# EAGLE design RPM EL311 (EAGLE 9.6.2)
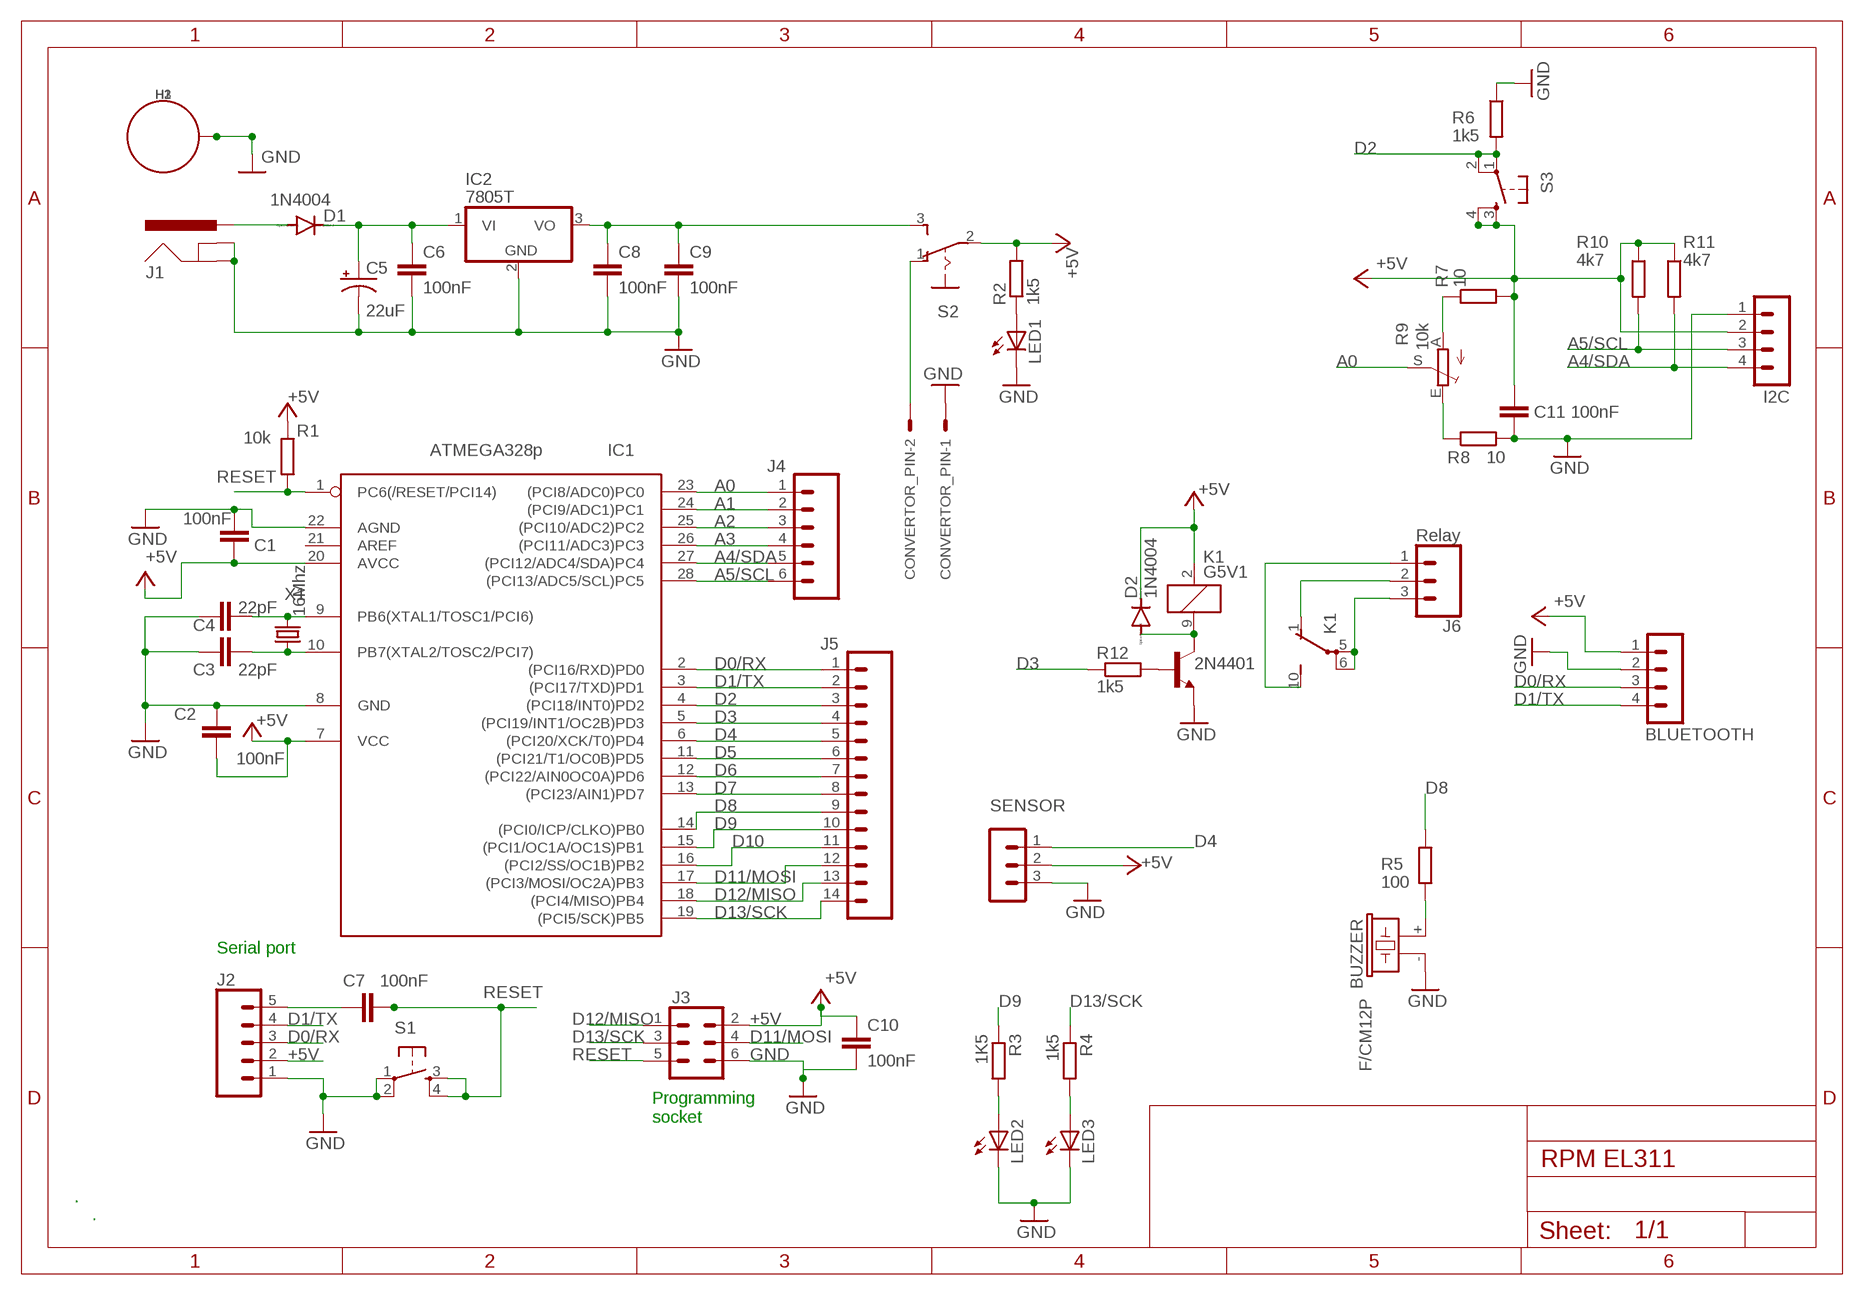
[diagram p0: schematic, sheet 1]

## Parts
2N4401  NPN_TRANSISTOR2N3904TO92-EBC  [TO92-EBC]
BLUETOOTH  MA04-1  [MA04-1]
BUZZER  F/CM12P  [F/CM12P]
C1  100nF  C2.5/2  [C2.5-2]
C2  100nF  C2.5/2  [C2.5-2]
C3  22pF  C2.5/2  [C2.5-2]
C4  22pF  C2.5/2  [C2.5-2]
C5  22uF  CPOL-USE2.5-7  [E2,5-7]
C6  100nF  C2.5/2  [C2.5-2]
C7  100nF  C2.5/2  [C2.5-2]
C8  100nF  C2.5/2  [C2.5-2]
C9  100nF  C2.5/2  [C2.5-2]
C10  100nF  C2.5/2  [C2.5-2]
C11  100nF  C2.5/2  [C2.5-2]
CONVERTOR_PIN  5V  CON-MOLEX_22-27-2021-02  [CON-MOLEX_6410-02]
D1  1N4004  [DO41-10]
D2  1N4004  [DO41-10]
H1  STANDOFF_ELECTRICAL  [STANDOFF-ELECTRICAL]
H2  STANDOFF_ELECTRICAL  [STANDOFF-ELECTRICAL]
H3  STANDOFF_ELECTRICAL  [STANDOFF-ELECTRICAL]
I2C  MA04-1  [MA04-1]
IC1  ATMEGA328p  ATMEGA168V-10P  [DIL28-3]
IC2  7805T  [TO220H]
J1  EL311-ROBOT_SPARKFUN-CONNECTORS_POWER_JACKPTH  [EL311-ROBOT_SPARKFUN-CONNECTORS_POWER_JACK_PTH]
J2  CONN_05  [1X05]
J3  FEMALE 2x3  CONN_03X2SHROUD  [2X3-SHROUDED]
J4  CONN_06SILK_FEMALE_PTH  [1X06]
J5  CONN_14  [1X14]
J6  Relay  CONN_03LONGPADS  [1X03_LONGPADS]
K1  G5V1  [G5V1]
LED1  LED3MM  [LED3MM]
LED2  LED3MM:1  [LED3MM]
LED3  LED3MM:1  [LED3MM]
R1  10k  R-EU_0207/10  [0207/10]
R2  1k5  R-EU_0207/10  [0207/10]
R3  1K5  R-EU_0207/10  [0207/10]
R4  1k5  R-EU_0207/10  [0207/10]
R5  100  R-EU_0207/10  [0207/10]
R6  1k5  R-EU_0207/10  [0207/10]
R7  10  R-EU_0207/10  [0207/10]
R8  10  R-EU_0207/10  [0207/10]
R9  10k  POT_TRIM_EU-RS3  [POT_RS3]
R10  4k7  R-EU_0207/10  [0207/10]
R11  4k7  R-EU_0207/10  [0207/10]
R12  1k5  R-EU_0207/10  [0207/10]
S1  EL311-ROBOT_SPARKFUN-ELECTROMECHANICAL_TAC_SWITCHPTH  [EL311-ROBOT_SPARKFUN-ELECTROMECHANICAL_TACTILE-PTH]
S2  SWITCH_M251  [SWITCH_M251]
S3  EL311-ROBOT_SPARKFUN-ELECTROMECHANICAL_TAC_SWITCHPTH  [EL311-ROBOT_SPARKFUN-ELECTROMECHANICAL_TACTILE-PTH]
SENSOR  MA03-1  [MA03-1]
X1  16Mhz  CRYSTALHC49U-V  [HC49U-V]

## Nets
0V: R8.1 R9.E
5V: R7.1 R9.A
+5V [power]: BLUETOOTH.1 C1.2 C2.2 C10.1 C11.1 D2.C I2C.2 IC1.7(VCC) IC1.20(AVCC) J2.2 J3.2 K1.2 R1.1 R2.2 R7.2 R10.1 R11.1 S2.2(P) S3.3 S3.4 SENSOR.2
A0: IC1.23((PCI8/ADC0)PC0) J4.1 R9.S
A1: IC1.24((PCI9/ADC1)PC1) J4.2
A2: IC1.25((PCI10/ADC2)PC2) J4.3
A3: IC1.26((PCI11/ADC3)PC3) J4.4
A4/SDA: I2C.4 IC1.27((PCI12/ADC4/SDA)PC4) J4.5 R11.2
A5/SCL: I2C.3 IC1.28((PCI13/ADC5/SCL)PC5) J4.6 R10.2
CONVERTOR: CONVERTOR_PIN.2 S2.1(O)
D0/RX: BLUETOOTH.3 IC1.2((PCI16/RXD)PD0) J2.3 J5.1
D1/TX: BLUETOOTH.4 IC1.3((PCI17/TXD)PD1) J2.4 J5.2
D2: IC1.4((PCI18/INT0)PD2) J5.3 R6.2 S3.1 S3.2
D3: IC1.5((PCI19/INT1/OC2B)PD3) J5.4 R12.1
D4: IC1.6((PCI20/XCK/T0)PD4) J5.5 SENSOR.1
D5: IC1.11((PCI21/T1/OC0B)PD5) J5.6
D6: IC1.12((PCI22/AIN0OC0A)PD6) J5.7
D7: IC1.13((PCI23/AIN1)PD7) J5.8
D8: IC1.14((PCI0/ICP/CLKO)PB0) J5.9 R5.1
D9: IC1.15((PCI1/OC1A/OC1S)PB1) J5.10 R3.1
D10: IC1.16((PCI2/SS/OC1B)PB2) J5.11
D11/MOSI: IC1.17((PCI3/MOSI/OC2A)PB3) J3.4 J5.12
D12/MISO: IC1.18((PCI4/MISO)PB4) J3.1 J5.13
D13/SCK: IC1.19((PCI5/SCK)PB5) J3.3 J5.14 R4.1
GND [power]: 2N4401.E BLUETOOTH.2 BUZZER.- C1.1 C2.1 C3.1 C4.1 C5.- C6.2 C8.2 C9.2 C10.2 C11.2 CONVERTOR_PIN.1 H1.P1 H2.P1 H3.P1 I2C.1 IC1.8(GND) IC1.22(AGND) IC2.2(GND) J1.GND J1.GNDBREAK J2.1 J3.6 LED1.K(C) LED2.K(C) LED3.K(C) R6.1 R8.2 S1.1 S1.2 SENSOR.3
LED2: LED2.A R3.2
LED3: LED3.A R4.2
N$9: J6.1 K1.10(2:S)
N$16: C3.2 IC1.10(PB7(XTAL2/TOSC2/PCI7)) X1.1
N$17: C4.2 IC1.9(PB6(XTAL1/TOSC1/PCI6)) X1.2
N$19: LED1.A R2.1
N$20: C7.1 J2.5
N$21: J6.2 K1.1(2:O)
N$22: J6.3 K1.5(2:P) K1.6(2:P)
N$23: 2N4401.C D2.A K1.9
N$24: 2N4401.B R12.2
PWR3 [power]: D1.A J1.PWR
PWR4 [power]: C5.+ C6.1 D1.C IC2.1(VI)
R5: BUZZER.+ R5.2
REGULATOR [power]: C8.1 C9.1 IC2.3(VO) S2.3(S)
RESET: C7.2 IC1.1(PC6(/RESET/PCI14)) J3.5 R1.2 S1.3 S1.4
Unconnected: IC1.21(AREF)

## Notes on the sheet
- Serial port
- Programming
  socket
- .
- .

## Library data of the parts
2N4401 = EL311_V1_2020:NPN_TRANSISTOR: NPN Transistor
BLUETOOTH I2C = con-lstb:MA04-1: PIN HEADER; OC_FARNELL: unknown; OC_NEWARK: unknown
BUZZER = buzzer:F/CM12P: BUZZER Source: Buerklin; OC_FARNELL: unknown; OC_NEWARK: unknown
C1-C4 C6-C11 = capacitor-wima:C: CAPACITOR naming: grid - package width
C5 = adafruit:CPOL-US: POLARIZED CAPACITOR, American symbol
CONVERTOR_PIN = EL311_V1_2020:CON-MOLEX_22-?-02: CONNECTOR wire to board 2.54 mm (.1 inch) pitch header; OC_FARNELL: unknown; OC_NEWARK: unknown
D1 = diode:1N4004: DIODE general purpose rectifier, 1 A
D2 = EL311_V1_2020:1N4004: DIODE general purpose rectifier, 1 A
H1-H3 = SparkFun-Hardware:STANDOFF_ELECTRICAL: Stand Off Drill holes with an electrical connection. For example, use these to ground your board to a chassis. Example SparkFun Products Screw - Phillips Head (1/4", 4-40, 10 pack) <https://www.sparkfun.com/products/10453> (PRT-10453) Screw - Phillips Head (1/2", 4-40, 10 pack) <https://www.sparkfun.com/products/10452> (PRT-10452) Screw - Phillips Head (3/4", 4-40, 10 pack) <https://www.sparkfun.com/products/10451> (PRT-10451) Screw - Phillips Head (1", 4-40, 10 pack) <https://www.sparkfun.com/products/10450> (PRT-10450)
IC1 = adafruit:ATMEGA168*P: MICROCONTROLLER 16 kBytes FLASH 1 kBytes SRAM 512 Bytes EEPROM USART 8-channel 10 bit ADC
IC2 = adafruit:78*: Positive VOLTAGE REGULATOR Added bigger pads to the TO-92 package
J1 = EL311_2017_18:EL311-ROBOT_SPARKFUN-CONNECTORS_POWER_JACK: Power Jack This is the standard 5.5mm barrel jack for power. The PTH is the most common, proven, reliable, footprint. The Slot footprint only works if the mill layer is transmitted to the PCB fab house so be warned. Mating wall wart : TOL-00298 (and others); PROD_ID: PRT-00119
J2 = SparkFun-Connectors:CONN_05: Multi connection point. Often used as Generic Header-pin footprint for 0.1 inch spaced/style header connections On any of the 0.1 inch spaced packages, you can populate with these: Break Away Headers - Straight <https://www.sparkfun.com/products/116> (PRT-00116) Break Away Male Headers - Right Angle <https://www.sparkfun.com/products/553> (PRT-00553) Female Headers <https://www.sparkfun.com/products/115> (PRT-00115) Break Away Headers - Machine Pin <https://www.sparkfun.com/products/117> (PRT-00117) Break Away Female Headers - Swiss Machine Pin <https://www.sparkfun.com/products/743> (PRT-00743) For SCREWTERMINALS and SPRING TERMINALS visit here: Screw Terimnals on SparkFun.com <https://www.sparkfun.com/search/results?term=Screw+Terminals> (5mm/3.5mm/2.54mm spacing) This device is also useful as a general connection point to wire up your design to another part of your project. Our various solder wires solder well into these plated through hole pads. Hook-Up Wire - Assortment (Stranded, 22 AWG) <https://www.sparkfun.com/products/11375> (PRT-11375) Hook-Up Wire - Assortment (Solid Core, 22 AWG) <https://www.sparkfun.com/products/11367> (PRT-11367) View the entire wire category on our website here <https://www.sparkfun.com/categories/141> Special notes: Molex polarized connector foot print use with SKU : PRT-08231 with associated crimp pins and housings. 1MM SMD Version SKU: PRT-10208
J3 = SparkFun-Connectors:CONN_03X2: Multi connection point. Often used as Generic Header-pin footprint for 0.1 inch spaced/style header connections You can populate with any combo of single row headers, but if you'd like an exact match, check these: Header - 2x3 (Male, 0.1") <https://www.sparkfun.com/products/12807> (PRT-12807) Header - 2x3 (Female, 0.1") <https://www.sparkfun.com/products/13010> (PRT-13010) 2x3 Pin Shrouded Header <https://www.sparkfun.com/products/10877> (PRT-10877) On any of the 0.1 inch spaced packages, you can populate with these: Break Away Headers - Straight <https://www.sparkfun.com/products/116> (PRT-00116) Break Away Male Headers - Right Angle <https://www.sparkfun.com/products/553> (PRT-00553) Female Headers <https://www.sparkfun.com/products/115> (PRT-00115) Break Away Headers - Machine Pin <https://www.sparkfun.com/products/117> (PRT-00117) Break Away Female Headers - Swiss Machine Pin <https://www.sparkfun.com/products/743> (PRT-00743) Special note: the shrouded connector mates well with our 3x2 ribbon cables: Ribbon Crimp Connector - 6-pin (2x3, Female) <https://www.sparkfun.com/products/10651> (PRT-10651) Ribbon Cable - 6 wire (15ft) <https://www.sparkfun.com/products/10646> (PRT-10646); PROD_ID: CONN-10681; SF_ID: PRT_10877
J4 = SparkFun-Connectors:CONN_06: Multi connection point. Often used as Generic Header-pin footprint for 0.1 inch spaced/style header connections On any of the 0.1 inch spaced packages, you can populate with these: Break Away Headers - Straight <https://www.sparkfun.com/products/116> (PRT-00116) Break Away Male Headers - Right Angle <https://www.sparkfun.com/products/553> (PRT-00553) Female Headers <https://www.sparkfun.com/products/115> (PRT-00115) Break Away Headers - Machine Pin <https://www.sparkfun.com/products/117> (PRT-00117) Break Away Female Headers - Swiss Machine Pin <https://www.sparkfun.com/products/743> (PRT-00743) Arduino Stackable Header - 6 Pin <https://www.sparkfun.com/products/9280> (PRT-09280) For SCREWTERMINALS and SPRING TERMINALS visit here: Screw Terimnals on SparkFun.com <https://www.sparkfun.com/search/results?term=Screw+Terminals> (5mm/3.5mm/2.54mm spacing) This device is also useful as a general connection point to wire up your design to another part of your project. Our various solder wires solder well into these plated through hole pads. Hook-Up Wire - Assortment (Stranded, 22 AWG) <https://www.sparkfun.com/products/11375> (PRT-11375) Hook-Up Wire - Assortment (Solid Core, 22 AWG) <https://www.sparkfun.com/products/11367> (PRT-11367) View the entire wire category on our website here <https://www.sparkfun.com/categories/141>; PROD_ID: CONN-08437
J5 = SparkFun-Connectors:CONN_14: Multi connection point. Often used as Generic Header-pin footprint for 0.1 inch spaced/style header connections On any of the 0.1 inch spaced packages, you can populate with these: Break Away Headers - Straight <https://www.sparkfun.com/products/116> (PRT-00116) Break Away Male Headers - Right Angle <https://www.sparkfun.com/products/553> (PRT-00553) Female Headers <https://www.sparkfun.com/products/115> (PRT-00115) Break Away Headers - Machine Pin <https://www.sparkfun.com/products/117> (PRT-00117) Break Away Female Headers - Swiss Machine Pin <https://www.sparkfun.com/products/743> (PRT-00743) For SCREWTERMINALS and SPRING TERMINALS visit here: Screw Terimnals on SparkFun.com <https://www.sparkfun.com/search/results?term=Screw+Terminals> (5mm/3.5mm/2.54mm spacing) This device is also useful as a general connection point to wire up your design to another part of your project. Our various solder wires solder well into these plated through hole pads. Hook-Up Wire - Assortment (Stranded, 22 AWG) <https://www.sparkfun.com/products/11375> (PRT-11375) Hook-Up Wire - Assortment (Solid Core, 22 AWG) <https://www.sparkfun.com/products/11367> (PRT-11367) View the entire wire category on our website here <https://www.sparkfun.com/categories/141> Special notes: Molex polarized connector foot print use with SKU : PRT-08231 with associated crimp pins and housings. 1MM SMD Version SKU: PRT-10208 NOTES ON THE VARIANTS LOCK and LOCK_LONGPADS... This footprint was designed to help hold the alignment of a through-hole component (i.e. 6-pin header) while soldering it into place. You may notice that each hole has been shifted either up or down by 0.005 of an inch from it's more standard position (which is a perfectly straight line). This slight alteration caused the pins (the squares in the middle) to touch the edges of the holes. Because they are alternating, it causes a "brace" to hold the component in place. 0.005 has proven to be the perfect amount of "off-center" position when using our standard breakaway headers. Although looks a little odd when you look at the bare footprint, once you have a header in there, the alteration is very hard to notice. Also,if you push a header all the way into place, it is covered up entirely on the bottom side.
J6 = EL311_V1_2020:CONN_03: Multi connection point. Often used as Generic Header-pin footprint for 0.1 inch spaced/style header connections On any of the 0.1 inch spaced packages, you can populate with these: Break Away Headers - Straight <https://www.sparkfun.com/products/116> (PRT-00116) Break Away Male Headers - Right Angle <https://www.sparkfun.com/products/553> (PRT-00553) Female Headers <https://www.sparkfun.com/products/115> (PRT-00115) Break Away Headers - Machine Pin <https://www.sparkfun.com/products/117> (PRT-00117) Break Away Female Headers - Swiss Machine Pin <https://www.sparkfun.com/products/743> (PRT-00743) Stackable Header - 3 Pin (Female, 0.1") <https://www.sparkfun.com/products/13875> (PRT-13875) For SCREWTERMINALS and SPRING TERMINALS visit here: Screw Terimnals on SparkFun.com <https://www.sparkfun.com/search/results?term=Screw+Terminals> (5mm/3.5mm/2.54mm spacing) This device is also useful as a general connection point to wire up your design to another part of your project. Our various solder wires solder well into these plated through hole pads. Hook-Up Wire - Assortment (Stranded, 22 AWG) <https://www.sparkfun.com/products/11375> (PRT-11375) Hook-Up Wire - Assortment (Solid Core, 22 AWG) <https://www.sparkfun.com/products/11367> (PRT-11367) View the entire wire category on our website here <https://www.sparkfun.com/categories/141> Special notes: Molex polarized connector foot print use with SKU : PRT-08232 with associated crimp pins and housings.; PROD_ID: CONN-10925; SF_ID: PRT-08235; SF_SKU: PRT-08433; VALUE: 1x3 RA Female .1"
K1 = EL311_V1_2020:G5V1: RELAY 1 x switch, 0.5 A/125 V AC, 1 A/24 V DC , Omron; MPN: G5V-1-DC24; OC_FARNELL: 9949593; OC_NEWARK: 36M6377
LED1 = adafruit:LED: LED OSRAM: - CHIPLED LG R971, LG N971, LY N971, LG Q971, LY Q971, LO R971, LY R971 LH N974, LH R974 LS Q976, LO Q976, LY Q976 LO Q996 - Hyper CHIPLED LW Q18S LB Q993, LB Q99A, LB R99A - SideLED LS A670, LO A670, LY A670, LG A670, LP A670 LB A673, LV A673, LT A673, LW A673 LH A674 LY A675 LS A676, LA A676, LO A676, LY A676, LW A676 LS A679, LY A679, LG A679 - Hyper Micro SIDELED® LS Y876, LA Y876, LO Y876, LY Y876 LT Y87S - SmartLED LW L88C, LW L88S LB L89C, LB L89S, LG L890 LS L89K, LO L89K, LY L89K LS L896, LA L896, LO L896, LY L896 - TOPLED LS T670, LO T670, LY T670, LG T670, LP T670 LSG T670, LSP T670, LSY T670, LOP T670, LYG T670 LG T671, LOG T671, LSG T671 LB T673, LV T673, LT T673, LW T673 LH T674 LS T676, LA T676, LO T676, LY T676, LB T676, LH T676, LSB T676, LW T676 LB T67C, LV T67C, LT T67C, LS T67K, LO T67K, LY T67K, LW E67C LS E67B, LA E67B, LO E67B, LY E67B, LB E67C, LV E67C, LT E67C LW T67C LS T679, LY T679, LG T679 LS T770, LO T770, LY T770, LG T770, LP T770 LB T773, LV T773, LT T773, LW T773 LH T774 LS E675, LA E675, LY E675, LS T675 LS T776, LA T776, LO T776, LY T776, LB T776 LHGB T686 LT T68C, LB T68C - Hyper Mini TOPLED® LB M676 - Mini TOPLED Santana® LG M470 LS M47K, LO M47K, LY M47K Source: http://www.osram.convergy.de/
LED2 LED3 = EL311_V1_2020:LED*?:1: LED OSRAM: - CHIPLED LG R971, LG N971, LY N971, LG Q971, LY Q971, LO R971, LY R971 LH N974, LH R974 LS Q976, LO Q976, LY Q976 LO Q996 - Hyper CHIPLED LW Q18S LB Q993, LB Q99A, LB R99A - SideLED LS A670, LO A670, LY A670, LG A670, LP A670 LB A673, LV A673, LT A673, LW A673 LH A674 LY A675 LS A676, LA A676, LO A676, LY A676, LW A676 LS A679, LY A679, LG A679 - Hyper Micro SIDELED® LS Y876, LA Y876, LO Y876, LY Y876 LT Y87S - SmartLED LW L88C, LW L88S LB L89C, LB L89S, LG L890 LS L89K, LO L89K, LY L89K LS L896, LA L896, LO L896, LY L896 - TOPLED LS T670, LO T670, LY T670, LG T670, LP T670 LSG T670, LSP T670, LSY T670, LOP T670, LYG T670 LG T671, LOG T671, LSG T671 LB T673, LV T673, LT T673, LW T673 LH T674 LS T676, LA T676, LO T676, LY T676, LB T676, LH T676, LSB T676, LW T676 LB T67C, LV T67C, LT T67C, LS T67K, LO T67K, LY T67K, LW E67C LS E67B, LA E67B, LO E67B, LY E67B, LB E67C, LV E67C, LT E67C LW T67C LS T679, LY T679, LG T679 LS T770, LO T770, LY T770, LG T770, LP T770 LB T773, LV T773, LT T773, LW T773 LH T774 LS E675, LA E675, LY E675, LS T675 LS T776, LA T776, LO T776, LY T776, LB T776 LHGB T686 LT T68C, LB T68C - Hyper Mini TOPLED® LB M676 - Mini TOPLED Santana® LG M470 LS M47K, LO M47K, LY M47K Source: http://www.osram.convergy.de/
R1-R8 R10-R12 = resistor:R-EU_: RESISTOR, European symbol
R9 = EL311_V1_2020:POT_TRIM_EU-: POTENTIOMETER
S1 S3 = EL311 LIB_2017_18:EL311-ROBOT_SPARKFUN-ELECTROMECHANICAL_TAC_SWITCH: Momentary Switch Button commonly used for reset or general input. Spark Fun Electronics SKU : COM-00097 SMT- SWCH-08247
S2 = EL311_V1_2020:SWITCH_M251: SLIDING SWITCH Mors, distributor Buerklin, 11G702
SENSOR = con-lstb:MA03-1: PIN HEADER; OC_FARNELL: unknown; OC_NEWARK: unknown
X1 = adafruit:CRYSTAL: CRYSTAL; OC_FARNELL: 1666969; OC_NEWARK: unknown

## Net classes
1 power: width 0.635 mm, drill 0.406 mm, clearance 0.457 mm

## Board
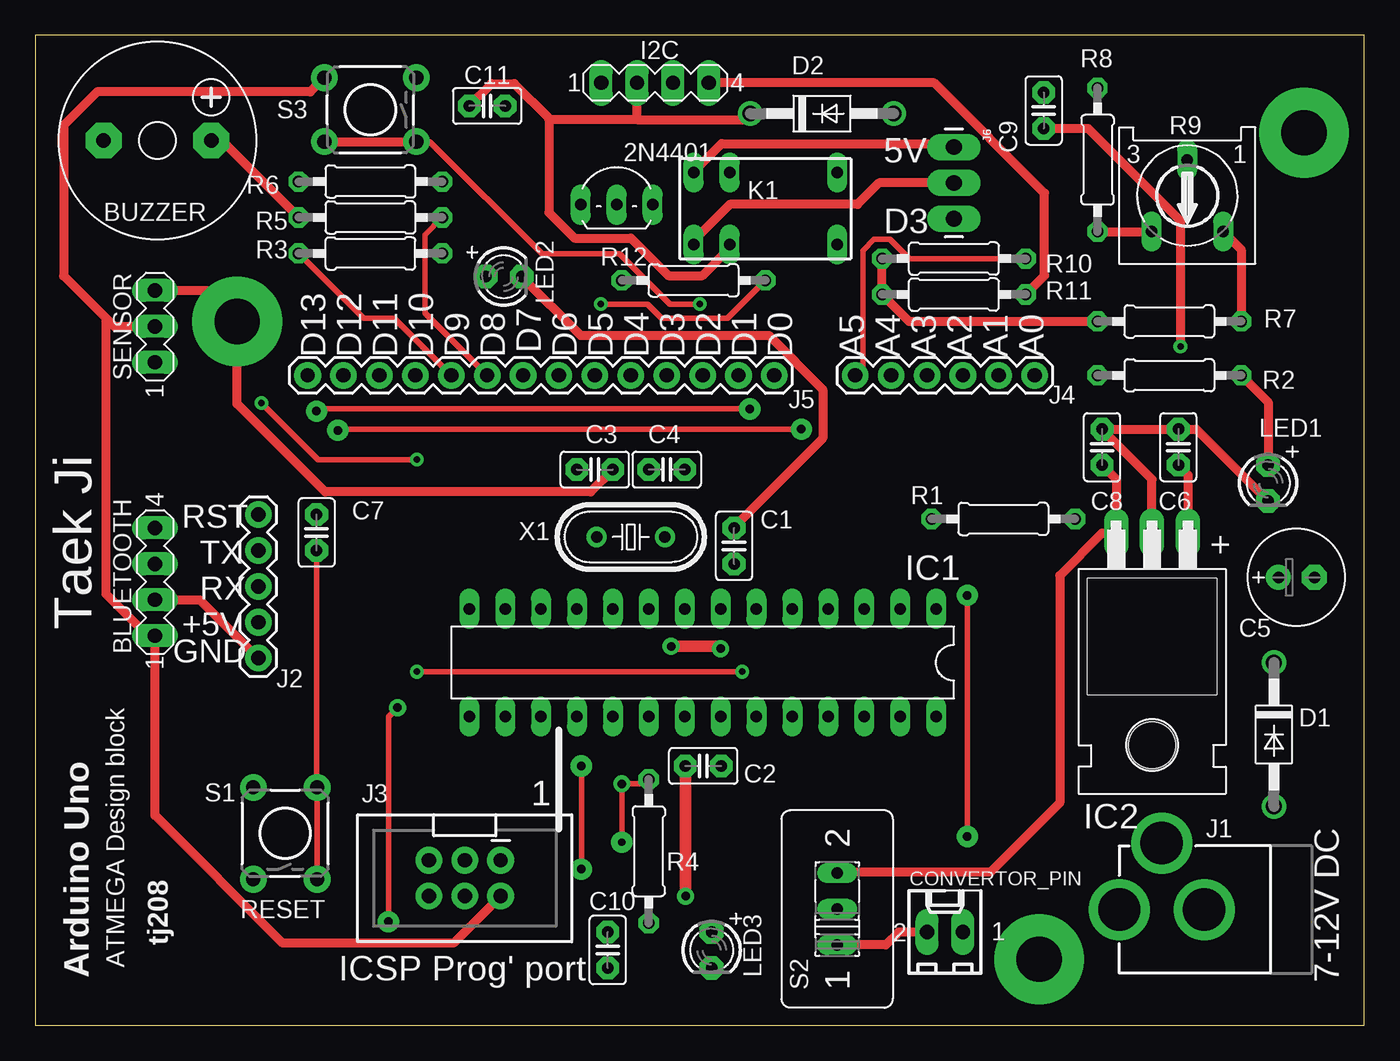
[diagram p1: board, top side]
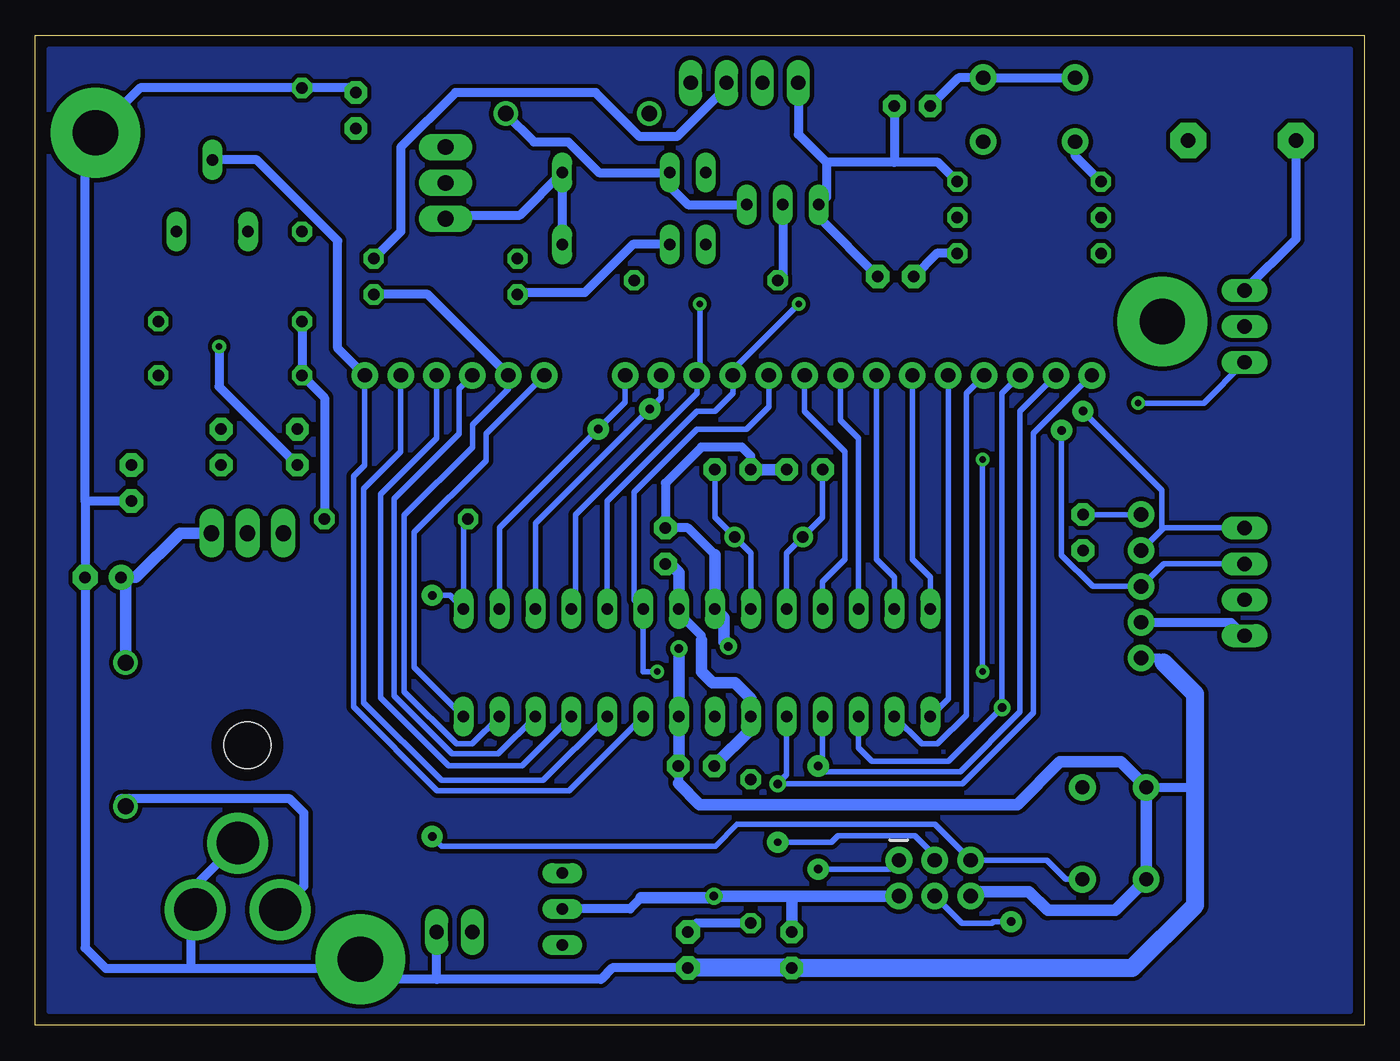
[diagram p2: board, bottom side, seen from below]

Size 94 x 70 mm. Coordinates in mm from the lower left corner, seen from the top.
Outline: 0,0 94,0 94,70 0,70 0,0
Copper layers (1*16): Top 0.035mm / dielectric 1.5mm / Bottom 0.035mm
Design rules "EL311_DRC_2020_V2": minimum track width 12mil, minimum drill 17mil, track to track 12mil, track to pad 12mil, pad to pad 12mil, via to via 12mil, smd to smd 12mil, copper to edge 12mil, drill to drill 15mil, minimum pad ring 12mil, minimum via ring 10mil, stop-mask expansion 4mil, vias tented up to drill 25mil, thermal gap 10mil

### Footprints (pad centres in the part's own frame; a part is rotated, then mirrored left to right if it is on the bottom)
TO92-EBC = drill 0.813 long: B 0,-1.27; C 2.54,-1.27; E -2.54,-1.27
MA04-1 = drill 1.016 long: 1 -3.81,0; 2 -1.27,0; 3 1.27,0; 4 3.81,0
F/CM12P = drill 1.016 pad 2.54 octagon: + 3.81,0; - -3.81,0
C2.5-2 = drill 0.813 pad 1.6 octagon: 1 -1.27,0; 2 1.27,0
E2,5-7 = drill 0.813 pad 1.778: + -1.27,0 | drill 0.813 pad 1.778 octagon: - 1.27,0
CON-MOLEX_6410-02 = drill 1.016 long: 1 1.27,0; 2 -1.27,0
DO41-10 = drill 1.118: A 5.08,0; C -5.08,0
STANDOFF-ELECTRICAL = drill 3.2 pad 6.35: P1 0,0
DIL28-3 = drill 0.813 long: 1 -16.51,-3.81; 2 -13.97,-3.81; 3 -11.43,-3.81; 4 -8.89,-3.81; 5 -6.35,-3.81; 6 -3.81,-3.81; 7 -1.27,-3.81; 8 1.27,-3.81; 9 3.81,-3.81; 10 6.35,-3.81; 11 8.89,-3.81; 12 11.43,-3.81; 13 13.97,-3.81; 14 16.51,-3.81; 15 16.51,3.81; 16 13.97,3.81; 17 11.43,3.81; 18 8.89,3.81; 19 6.35,3.81; 20 3.81,3.81; 21 1.27,3.81; 22 -1.27,3.81; 23 -3.81,3.81; 24 -6.35,3.81; 25 -8.89,3.81; 26 -11.43,3.81; 27 -13.97,3.81; 28 -16.51,3.81
TO220H = drill 1.118 long: 1 -2.54,-10.16; 2 0,-10.16; 3 2.54,-10.16 | hole 3.302: 0,4.826
EL311-ROBOT_SPARKFUN-CONNECTORS_POWER_JACK_PTH = drill 2.997 pad 4.318: GND 0,7.7; GNDBREAK 4.7,10.7; PWR 0,13.7
1X05 = drill 1.016 pad 1.88: 1 0,0; 2 2.54,0; 3 5.08,0; 4 7.62,0; 5 10.16,0
2X3-SHROUDED = drill 1.016 pad 1.88: 1 -1.27,2.54; 2 1.27,2.54; 3 -1.27,0; 4 1.27,0; 5 -1.27,-2.54; 6 1.27,-2.54
1X06 = drill 1.016 pad 1.88: 1 0,0; 2 2.54,0; 3 5.08,0; 4 7.62,0; 5 10.16,0; 6 12.7,0
1X14 = drill 1.016 pad 1.88: 1 0,0; 2 2.54,0; 3 5.08,0; 4 7.62,0; 5 10.16,0; 6 12.7,0; 7 15.24,0; 8 17.78,0; 9 20.32,0; 10 22.86,0; 11 25.4,0; 12 27.94,0; 13 30.48,0; 14 33.02,0
1X03_LONGPADS = drill 1.118 pad 1.88 long: 1 0,0; 2 2.54,0; 3 5.08,0
G5V1 = drill 0.813 long: 1 -5.08,-2.54; 2 -2.54,-2.54; 5 5.08,-2.54; 6 5.08,2.54; 9 -2.54,2.54; 10 -5.08,2.54
LED3MM = drill 0.813 pad 1.676 octagon: A -1.27,0; K 1.27,0
0207/10 = drill 0.813 octagon: 1 -5.08,0; 2 5.08,0
POT_RS3 = drill 0.813 long: A -2.54,2.54; E 2.54,2.54; S 0,-2.54
EL311-ROBOT_SPARKFUN-ELECTROMECHANICAL_TACTILE-PTH = drill 1.016 pad 1.88: 1 -3.251,2.261; 2 3.251,2.261; 3 -3.251,-2.261; 4 3.251,-2.261
SWITCH_M251 = drill 0.813 long: 1 -2.54,0; 2 0,0; 3 2.54,0
MA03-1 = drill 1.016 long: 1 -2.54,0; 2 0,0; 3 2.54,0
HC49U-V = drill 0.813: 1 -2.413,0; 2 2.413,0

### Placement (x,y rotation side)
2N4401  41.12,59.3 0 top
BLUETOOTH  8.46,31.36 90 top
BUZZER  8.64,62.56 0 top
C1  49.42,33.9 270 top
C2  47.25,18.34 180 top
C3  39.58,39.29 180 top
C4  44.66,39.29 0 top
C5  89.2,31.67 0 top
C6  80.86,40.88 90 top
C7  19.89,34.85 270 top
C8  75.46,40.88 90 top
C9  71.33,64.69 90 top
C10  40.48,5.32 270 top
C11  31.96,65.01 0 top
CONVERTOR_PIN  64.34,6.59 0 top
D1  87.62,20.56 270 top
D2  55.65,64.47 0 top
H1  71.01,4.67 0 top
H2  89.75,63.1 0 top
H3  14.28,49.77 0 top
I2C  43.84,66.64 0 top
IC1  47.2,25.64 180 top
IC2  79,24.64 180 top
J1  90.38,8.18 90 top
J2  15.77,25.96 90 top
J3  30.37,10.4 270 top
J4  70.69,45.96 180 top
J5  52.28,45.96 180 top
J6  64.98,62.1 270 top
K1  51.65,57.76 0 top
LED1  87.2,38.34 270 top
LED2  33.13,52.95 0 top
LED3  47.84,5.32 270 top
R1  68.47,35.8 180 top
R2  80.22,45.96 180 top
R3  23.7,54.58 0 top
R4  43.39,12.3 270 top
R5  23.7,57.12 180 top
R6  23.7,59.66 180 top
R7  80.22,49.77 180 top
R8  75.14,61.2 90 top
R9  81.49,58.66 180 top
R10  64.98,54.22 0 top
R11  64.98,51.67 0 top
R12  46.56,52.67 180 top
S1  17.67,13.57 90 top
S2  56.73,8.22 90 top
S3  23.7,64.74 180 top
SENSOR  8.46,49.42 90 top
X1  42.12,34.53 0 top

### Tracks (layer width: path | path; a pad name or v marks a point on that pad's centre or on a via)
0V
  Top 0.635: R8.1 R9.E
5V
  Top 0.635: R9.A 85.3,54.85 R7.1
+5V  (via drill 0.6 pad 1.2)
  Top 0.635: R7.2 61.8,49.77 R11.1 R10.1 | S3.4 19.45,66 4.37,66 2,63.63 2,53 5,50 | 5,50 5.58,49.42 SENSOR.2 | 42.56,64.04 36.34,64.04 | 42.56,64.04 I2C.2 | J3.2 29.59,5.8 17.51,5.8 8.46,14.85 BLUETOOTH.1 7.95,27.55 5,30.49 5,50 | C11.1 32.27,66.58 33.88,66.58 36.34,64.13 36.34,64.04 | 36.34,64.04 36.34,57.46 38.13,55.66 42.13,55.66 44.77,53.02 47.18,53.02 49.1,54.94 K1.2 | 42.56,64.04 50.14,64.04 D2.C
  Top 0.813: C2.2 45.98,9.15 v45.99,9.13
  Bottom 0.635: 46.88,27.23 46.88,27.55 48.47,29.13 IC1.7 | C11.1 28.7,67 S3.3 S3.4 | J2.2 9.42,28.5 BLUETOOTH.1 | R7.2 R2.2 73.55,44.37 R1.1 | K1.2 51.74,55.22 55.14,51.81 59.76,51.81 R11.1 | 51.14,9 51.91,8.22 S2.2
  Bottom 0.813: IC1.7 48.47,31.99 49.1,32.62 C1.2 | J3.2 40.48,9.13 | 40.48,9.13 v45.99,9.13 46.12,9 51.14,9 | C2.2 43.39,20.93 IC1.20 43.39,23.1 44.5,24.21 46.09,24.21 46.88,25 46.88,27.23 | C10.1 40.48,9.13
A0
  Bottom 0.406: J4.1 70.69,39.61 71.48,38.82 71.48,22.51 65.57,16.6 56.24,16.6 IC1.23
  Bottom 0.635: J4.1 72.6,47.87 72.6,55.47 78.33,61.2 R9.S
A1
  Bottom 0.406: J4.2 68.16,40.56 70.77,37.95 70.77,22.8 65.28,17.31 58.07,17.31 IC1.24
A2
  Bottom 0.406: J4.3 65.61,41.52 69.58,37.55 69.58,23.15 64.78,18.34 59.58,18.34 IC1.25
A3
  Bottom 0.406: J4.4 64.03,45.01 64.03,41.83 68.62,37.23 68.62,23.3 64.51,19.19 61.27,19.19 IC1.26
A4/SDA
  Top 0.635: I2C.4 63.59,66.64 71.39,58.84 71.39,53.01 R11.2
  Bottom 0.406: J4.5 60.53,45.01 63.08,42.47 63.08,40.88 67.9,36.05 67.9,23.59 64.22,19.9 63.1,19.9 IC1.27
  Bottom 0.635: J4.5 66.25,51.67 R11.2
A5/SCL
  Top 0.406: J4.6 58.53,46.49 58.53,54.78 59.33,55.59 60.47,55.59 61.84,54.22 R10.2
  Bottom 0.406: J4.6 62.12,41.83 62.12,39.93 67.19,34.86 67.19,25.31 IC1.28
  Bottom 0.635: R10.2 68.16,56.12 68.16,62.08 64.28,65.96 54.37,65.96 51.24,62.83 48.62,62.83 45.1,66.34 I2C.3
BOTTOM-COPPER
  pour Bottom: 1,69 1,1 93,1 93,69
CONVERTOR
  Top 0.635: CONVERTOR_PIN.2 61.08,6.59 60.17,5.68 S2.1
D0/RX  (via drill 0.6 pad 1.5)
  Top 0.406: v54.19,42.15 21.48,42.15 v21.4,42.07
  Bottom 0.406: IC1.2 61.17,35.16 v54.19,42.15 52.28,44.05 J5.1 | v21.4,42.07 21.4,33.24 19.2,31.04 J2.3 14.18,32.62 BLUETOOTH.3
D1/TX  (via drill 0.6 pad 1.5)
  Top 0.406: v50.53,43.58 20.05,43.58 v19.89,43.42
  Bottom 0.406: IC1.3 58.63,35.48 v50.53,43.58 49.74,44.37 J5.2 | v19.89,43.42 14.32,37.84 14.32,35.02 J2.4 14.18,35.16 BLUETOOTH.4
D2  (via drill 0.46)
  Top 0.406: S3.1 27.91,62.48 35.84,54.55 41.34,54.55 44.88,51 v47,51
  Top 0.635: S3.2 S3.1
  Bottom 0.406: IC1.4 55.77,29.77 55.77,36.12 47.2,44.69 J5.3 47,45.96 v47,51
  Bottom 0.635: S3.2 20.45,61.49 R6.2
D3  (via drill 0.46)
  Top 0.406: v40,51 43.29,51 44.28,50.01 48.98,50.01 R12.1
  Bottom 0.406: IC1.5 53.55,37.07 47.2,43.42 45.93,43.42 44.66,44.69 J5.4 44.66,46.34 v40,51
D4  (via drill 0.46)
  Top 0.406: v50,25 v27,25 | v27,40 20,40 v16,44
  Bottom 0.406: J5.5 42.12,43.74 43.71,42.15 47.2,42.15 51.65,37.7 51.65,30.09 IC1.6 51.01,25 v50,25 | v27,40 v27,25 | v16,44 11.35,44 SENSOR.1
D5
  Bottom 0.406: J5.6 39.58,43.42 36.72,40.56 36.72,32.94 38.31,31.36 IC1.11
D6
  Bottom 0.406: IC1.12 35.77,41.52 37.04,42.78 J5.7
D7
  Bottom 0.406: J5.8 34.5,32.94 33.23,31.67 IC1.13
D8
  Top 0.406: R5.1 27.57,55.9 27.57,50.35 J5.9
  Bottom 0.406: J5.9 31.96,32.94 30.69,31.67 IC1.14
D9
  Top 0.406: R3.1 23.2,50 25.38,50 J5.10
  Bottom 0.406: IC1.15 29.42,23.1 J5.10
D10
  Bottom 0.406: J5.11 28.15,44.69 28.15,21.93 30.18,19.9 31.3,19.9 IC1.16
D11/MOSI  (via drill 0.6 pad 1.2, 0.6 pad 1.5)
  Top 0.406: v24.98,7.33 24.98,21.83 v25.61,22.46
  Bottom 0.406: J3.4 28.47,7.22 26.35,7.22 26.25,7.33 v24.98,7.33 | IC1.17 35.77,19.61 34.82,18.66 29.42,18.66 v25.61,22.46 25.61,44.69 J5.12
D12/MISO  (via drill 0.6 pad 1.5)
  Top 0.406: v38.63,18.34 v38.63,11.04
  Bottom 0.406: J5.13 24.34,43.42 24.34,22.17 28.56,17.94 38.23,17.94 v38.63,18.34 38.31,18.66 IC1.18 | v38.63,11.04 33.55,11.04 J3.1
D13/SCK  (via drill 0.51 pad 1.5, 0.6 pad 1.2)
  Top 0.406: v41.48,12.94 v41.48,17.07 43.07,17.07 R4.1
  Bottom 0.406: J3.3 30.37,11.99 31.77,13.38 37.23,13.38 37.67,12.94 v41.48,12.94 | IC1.19 40.85,17.7 v41.48,17.07 28.43,17.07 23.39,22.11 23.39,41.87 19.29,45.96 J5.14
GND  (via drill 0.6 pad 1.2)
  Top 0.635: LED1.K 82.12,42.15 C6.2 C8.2 79,38.61 IC2.2 | BLUETOOTH.2 11.64,30.09 J2.1 | C3.1 39.27,37.72 20.5,37.72 14.28,43.95 H3.P1 12.09,51.96 SENSOR.3 | LED2.K 38.57,48.78 51.89,48.78 55.71,44.95 55.71,41.52 49.42,35.23 C1.1
  Top 0.813: v48.47,26.64 48.31,26.8 v44.98,26.8
  Bottom 0.635: C4.1 43.39,40.24 44.02,40.88 46.88,40.88 49.42,38.34 C1.1 47.84,35.16 45.93,33.26 | C2.1 48.52,17.11 | C9.2 71.65,66.28 R8.2 86.57,66.28 H2.P1 90.47,62.38 90.47,37.07 | 14.18,25.64 14.5,25.96 J2.1 | BUZZER.- 4.83,55.59 SENSOR.3 | 65.61,3.25 CONVERTOR_PIN.1 | C11.2 33.23,61.01 | 65.61,3.25 71.01,3.25 H1.P1 71.68,4 83,4 | 65.61,3.25 54,3.25 53.2,4.05 LED3.K | LED2.K 38.58,57.12 2N4401.E 38.03,58.57 38.03,61.01 | R6.1 30.14,61.01 33.23,61.01 | I2C.1 40.02,63 38.03,61.01 | 90.47,37.07 C5.- 90.47,5.47 89,4 83,4 | LED1.K 90.47,37.07 | 83,4 83,7.86 J1.GND 82.68,9.88 J1.GNDBREAK | S1.2 12.13,16.83 11.96,17 | 33.23,61.01 38.03,61.01
  Bottom 0.813: C3.1 C4.1 | 45.93,33.26 IC1.8 45.3,28.82 45.3,27.12 v44.98,26.8 | J3.6 27.52,9.45 23.7,9.45 22.38,8.13 17.61,8.13 S1.1 S1.2 17.21,18.63 21.51,18.63 24.53,15.6 47.01,15.6 48.52,17.11 | C2.1 48.47,18.39 IC1.22 v48.47,26.64
  Bottom 1.27: 14.18,25.64 11.96,23.42 11.96,17 11.96,8.49 16.4,4.05 C10.2 LED3.K
LED2
  Bottom 0.635: R3.2 30.23,54.58 LED2.A
LED3
  Bottom 0.635: R4.2 47.2,7.22 LED3.A
N$9
  Top 0.635: K1.10 46.56,60.35 48.55,62.34 64.75,62.34 J6.1
N$16
  Bottom 0.406: IC1.10 40.85,33.39 X1.1 38.31,35.93 C3.2
N$17
  Bottom 0.406: IC1.9 43.39,33.39 X1.2 45.93,35.93 C4.2
N$19
  Top 0.635: R2.1 87.2,44.05 LED1.A
N$20
  Bottom 0.406: J2.5 C7.1
N$21
  Top 0.635: J6.2 59.68,59.56 58.16,58.05 49.12,58.05 46.56,55.49 K1.1
N$22
  Bottom 0.635: J6.3 64.98,57.3 59.73,57.3 K1.6 K1.5
N$23
  Bottom 0.635: D2.A 58.73,62.47 56.3,62.47 54.13,60.3 K1.9 49.1,59.3 47.84,58.02 2N4401.C
N$24
  Bottom 0.635: 2N4401.B 41.12,53.04 R12.2
PWR3
  Bottom 0.635: J1.PWR 75,9.86 75,15 76,16 88,16 88,15.86 D1.A
PWR4
  Top 0.635: C6.1 81.54,38.93 IC2.1
  Bottom 0.813: IC2.1 83.76,34.8 86.89,31.67 C5.+ 87.62,31.36 D1.C
R5
  Top 0.635: R5.2 13.18,62.56 BUZZER.+
REGULATOR  (via drill 0.46)
  Top 0.635: C8.1 76.46,38.61 IC2.3 75.46,34.8 72.46,31.8 72.46,15.72 67.56,10.83 56.79,10.83 S2.3 | C9.1 74.46,63.42 81,56.88 v81,48
  Bottom 0.635: v81,48 81,45.15 C8.1
RESET  (via drill 0.6 pad 1.5)
  Top 0.406: C7.2 19.89,16.86 S1.4 S1.3 | v65.93,30.4 v65.93,13.35
  Bottom 0.406: v65.93,30.4 64.66,30.4 IC1.1 63.71,35.48 R1.2 | S1.3 21.09,10.32 22.43,11.67 J3.5 30.36,14.2 44.35,14.2 45.88,12.67 65.25,12.67 v65.93,13.35

### Text on the board
tNames: 5V | D3 | D7 | D13 | D12 | D11 | D10 | D9 | D8 | D6 | D5 | D4 | D3 | D2 | D1 | D0 | A5 | A4 | A3 | A2 | A1 | A0 | RST | TX | + | RX | Taek Ji | +5V | GND | 1 | ATMEGA Design block | tj208 | RESET | 7-12V DC | ICSP Prog' port | Arduino Uno